# EasyEDA Pro project ProDoc_TC264主板V2.0_2025-08-21.epro, board PCB1_4
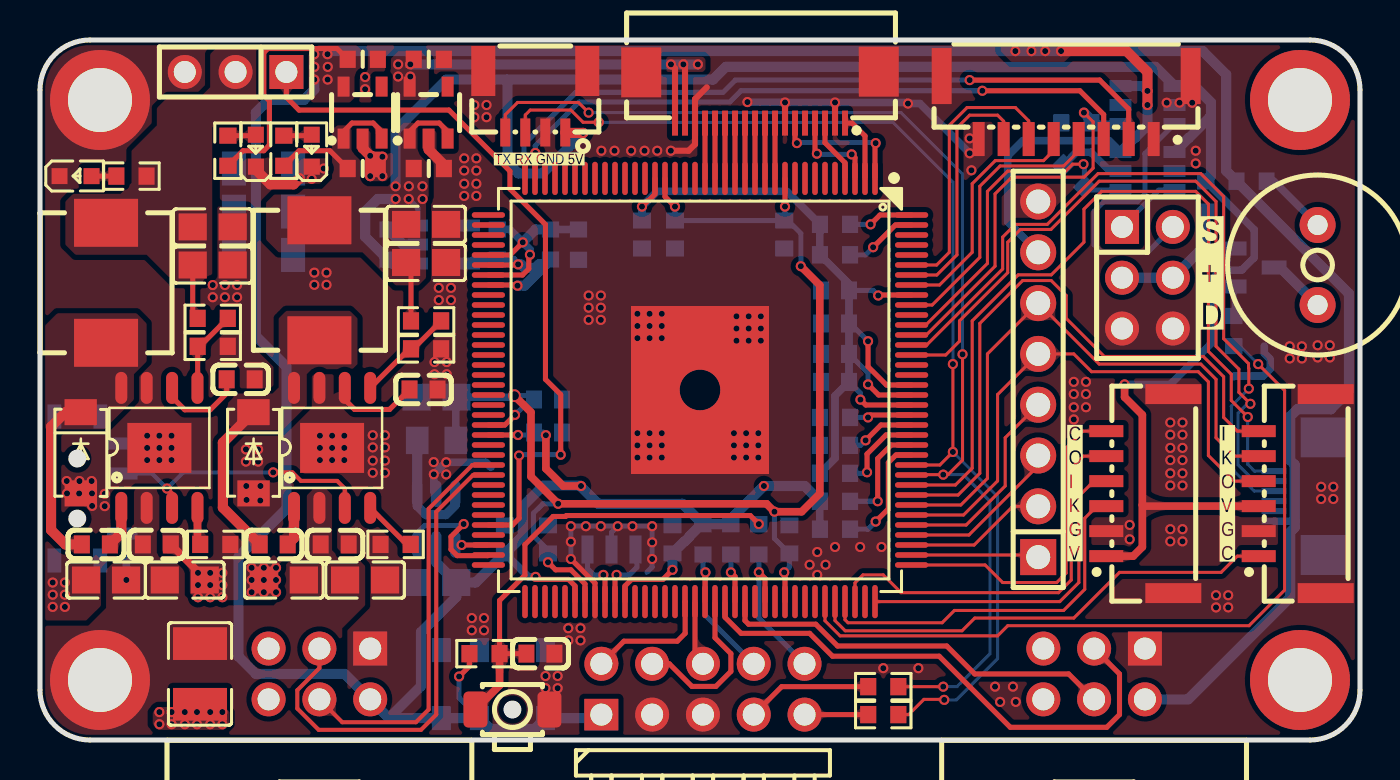
[diagram p1: board, top side]
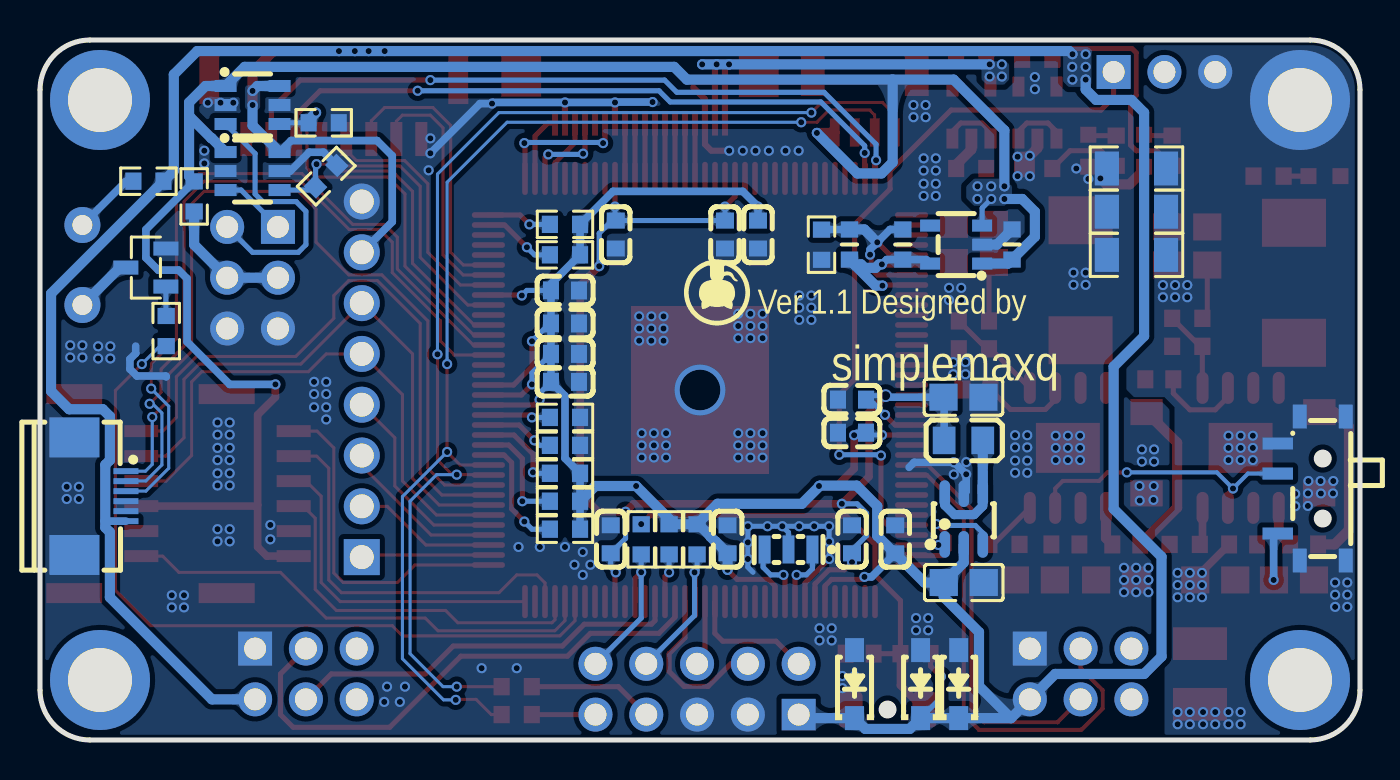
[diagram p2: board, bottom side, seen from below]

Outline 66 x 35 mm; copper layers: Top Layer, Bottom Layer. Coordinates in mm from the lower left corner of the outline.
Outline path: 0,32.5 0,2.5 arc(0.73,0.73) 2.5,0 63.5,0 arc(65.27,0.73) 66,2.5 66,32.5 arc(65.27,34.27) 63.5,35 2.5,35 arc(0.73,34.27) 0,32.5
Stack: Top Layer 0.035mm / Dielectric1 1.51mm FR4 er 4.5 / Bottom Layer 0.035mm

## Design rules (mm)
template: 自定义配置
spacing copperThickness1oz (default): track to track 0.102, other pairs 0.152 to 0.3
spacing copperThickness2oz: track to track 0.203, other pairs 0.152 to 0.3
track width copperThickness1oz (default): min 0.127, default 0.254, max 2.54
track width copperThickness2oz: min 0.203, default 0.254, max 2.54
differential pair differentialPair (default): width min 0.127, default 0.254, max 2.54; gap min 0.152, default 0.152
via viaSize (default): diameter min 0.5, default 0.61, max 10; hole min 0.3, default 0.305, max 6.3

## Placement (name value [footprint] x y rotation side)
BUZZER2  2.7kHz  [BUZ-TH_BD9.0-P4.00-D0.6-FD]  63.88 23.75 270 top
C3  100nF  [C0603]  25.02 4.32 180 top
C4  100nF  [C0603]  37.47 10.03 270 bottom
C5  100nF  [C0603]  25.4 10.03 270 bottom
C6  100nF  [C0603]  25.4 17.02 180 bottom
C7  100nF  [C0603]  31.75 25.27 90 bottom
C8  100nF  [C0603]  39.75 19.3 0 bottom
C9  100nF  [C0603]  31.62 10.03 270 bottom
C10  100nF  [C0603]  37.21 25.27 90 bottom
C11  100nF  [C0603]  39.75 20.83 0 bottom
C12  100nF  [C0603]  39.75 22.48 0 bottom
C13  100nF  [C0603]  30.1 25.27 90 bottom
C14  100nF  [C0603]  25.4 15.37 180 bottom
C15  100nF  [C0603]  23.24 10.03 270 bottom
C16  100nF  [C0603]  39.75 17.91 0 bottom
C19  22uF  [C0805]  19.81 7.87 0 bottom
C24  22uF  [C0805]  19.83 17.14 0 bottom
C30  100nF  [C0603_S]  16.13 28.58 180 top
C31  100nF  [C0603_S]  16.13 34.04 180 top
C41  100nF  [C0603_S]  17.4 24.77 270 bottom
C42  100nF  [C0603_S]  25.53 24.77 270 bottom
C43  100nF  [C0603_S]  22.86 24.77 270 bottom
C74  100nF  [C0603_S]  19.43 28.58 180 top
C75  100nF  [C0603_S]  19.43 34.04 180 top
C78  100nF  [C0603]  2.79 9.78 180 top
C79  22uF  [C0805]  8.64 23.75 180 top
C80  22uF  [C0805]  8.64 25.65 180 top
C81  100nF  [C0603]  5.84 9.78 180 top
C82  22nF  [C0603]  10.03 18.03 0 top
C83  22uF  [C0805]  3.3 8 0 top
C84  22uF  [C0805]  7.24 8 180 top
C85  100nF  [C0603]  11.68 9.78 180 top
C86  22uF  [C0805]  19.3 23.88 180 top
C87  22uF  [C0805]  19.3 25.78 180 top
C88  100nF  [C0603]  14.73 9.78 180 top
C89  22nF  [C0603]  19.18 17.53 0 top
C90  22uF  [C0805]  12.19 8 0 top
C91  22uF  [C0805]  16.26 8 180 top
CN9  2.54-2*3P弯简牛  [IDC-TH_6P-P2.54-H-R2-C3-S2.54]  13.97 3.3 0 top
CN10  2.54-2*3P弯简牛  [IDC-TH_6P-P2.54-H-R2-C3-S2.54]  52.71 3.3 0 top
CN14  WAFER-SH1.0-4PWB  [CONN-SMD_4P-P1.00_WAFER-SH1.0-4PWB]  24.76 31.75 180 top
D8  MMSZ3V6CW  [SOD-123_L2.7-W1.6-LS3.7-RD-1]  20.07 2.79 90 bottom
D9  MMSZ3V6CW  [SOD-123_L2.7-W1.6-LS3.7-RD-1]  21.97 2.79 90 bottom
D10  MMSZ3V6CW  [SOD-123_L2.7-W1.6-LS3.7-RD-1]  25.27 2.79 90 bottom
D11  SS54  [SMA_L4.3-W2.6-LS5.0-FD]  2.03 14.35 90 top
D12  SS54  [SMA_L4.3-W2.6-LS5.0-FD]  10.67 14.35 90 top
FPC1  FPC-05F-18PH20  [FPC-SMD_18P-P0.50_FPC-05F-18PH20]  36 32.13 180 top
FPC3  FPC-05F-6PH20  [FPC-SMD_6P-P0.50_XUNPU_FPC-05F-6PH20]  62.99 12.19 270 bottom
H3  PZ254V-11-03P  [HDR-TH_3P-P2.54-V-M]  9.78 33.4 180 top
H14  2.54-2*5P弯针  [HDR-TH_10P-P2.54-H-M-R2-C5-S2.54-W12.9]  33.15 2.54 0 top
H15  PZ254V-12-6P  [HDR-TH_6P-P2.54-V-M-R2-C3-S2.54]  55.37 23.11 270 top
L1  4.7uH  [L0805]  19.83 14.98 0 bottom
L12  4.7uH  [IND-SMD_L7.0-W6.6]  13.97 22.99 90 top
L13  4.7uH  [IND-SMD_L7.0-W6.6]  3.3 22.86 90 top
LED14  NCD0603R1  [LED0603-RD_RED]  10.79 29.46 90 top
LED15  NCD0603R1  [LED0603-RD_RED]  13.59 29.46 90 top
LED16  NCD0603W1  [LED0603-RD]  1.78 28.19 0 top
NOREF  -  [Pad_e54]  63 32 0 top
NOREF#2  -  [Pad_e47]  3 3 0 top
NOREF#3  -  [Pad_e51]  3 32 0 top
NOREF#4  -  [Pad_e44]  63 3 0 top
P1  2.54-1*8P母环保  [HDR-TH_8P-P2.54-V-F-1]  49.91 18.03 90 top
Q1  BSL215CH6327  [TSOP-6_L3.0-W1.5-P0.95-LS2.8-BL]  19.81 11.05 180 bottom
Q9  S8050  [SOT-23-3_L2.9-W1.3-P1.90-LS2.4-BR]  60.71 23.62 180 bottom
R1  10kΩ  [R0603]  22.22 4.32 0 top
R2  680Ω  [R0603]  35.94 10.03 270 bottom
R14  4.7K  [R0603]  59.69 20.45 90 bottom
R47  4.7kΩ  [R0603]  12.19 29.46 270 top
R48  0R  [R0603]  42.16 2.67 180 top
R49  0R  [R0603]  42.16 1.27 180 top
R69  47K  [R0603]  39.75 16.13 180 bottom
R70  47K  [R0603]  39.75 14.73 180 bottom
R71  47K  [R0603]  39.75 10.54 180 bottom
R72  47K  [R0603]  39.75 11.94 180 bottom
R73  47K  [R0603]  39.75 24.26 180 bottom
R74  47K  [R0603]  39.75 25.78 180 bottom
R75  47K  [R0603]  39.75 13.33 180 bottom
R76  10K  [R0603]  34.54 10.03 90 bottom
R77  10K  [R0603]  33.15 10.03 90 bottom
R90  4.7kΩ  [R0603]  9.4 29.46 270 top
R92  10K  [R0603]  51.69 28.19 315 bottom
R93  4.7kΩ  [R0603]  4.57 28.19 180 top
R96  N/C  [R0603]  58.29 27.18 270 bottom
R97  10K  [R0603]  51.82 30.86 0 bottom
R102  4.7Ω  [R0603]  60.58 27.94 0 bottom
R103  16.9kΩ  [R0603]  8.76 9.78 180 top
R104  91kΩ  [R0603]  8.64 21.08 180 top
R105  12kΩ  [R0603]  8.64 19.69 180 top
R106  16.9kΩ  [R0603]  17.78 9.78 0 top
R107  91kΩ  [R0603]  19.3 20.95 180 top
R108  16kΩ  [R0603]  19.3 19.56 180 top
R109  0Ω  [R1206]  11.18 28.58 180 bottom
R110  0Ω  [R1206]  11.18 26.42 180 bottom
R111  0Ω  [R1206]  11.18 24.26 180 bottom
R112  0Ω  [R0603]  26.92 24.77 90 bottom
SW1  MSK12C02  [SW-TH_MSK12C02]  2.41 12.57 90 bottom
SW2  TS-1063S-B3D4  [KEY-SMD_L3.0-W2.5-LS4.0_TS-1603S]  23.62 1.52 0 top
U1  SAK-TC264DA-40F200N BC  [LQFP-144_L20.0-W20.0-P0.50-LS22.0-BL-EP-1]  33 17.5 180 top
U2  WAFER-GH1.25-6PLB  [CONN-SMD_6P-P1.25_XUNPU_WAFER-GH1.25-6PLB]  54.99 12.32 90 top
U3  XC6210B332MR  [SOT-23-5_L3.0-W1.7-P0.95-LS2.8-BR]  16.13 31.37 270 top
U4  LP5907QMFX-3.3Q1  [SOT-23-5_L3.0-W1.7-P0.95-LS2.8-BR]  20.19 24.77 180 bottom
U50  SN74LVC1T45DBVR  [SOT-23-6_L2.9-W1.6-P0.95-LS2.8-BR]  55.37 31.75 0 bottom
U51  SN74LVC1T45DBVR  [SOT-23-6_L2.9-W1.6-P0.95-LS2.8-BR]  55.37 28.45 0 bottom
U52  WAFER-GH1.25-8PWB  [CONN-SMD_8P-P1.25_XUNPU-WAFER-GH1.25-8PWB]  51.31 31.62 180 top
U54  XC6210B332MR  [SOT-23-5_L3.0-W1.7-P0.95-LS2.8-BR]  19.43 31.37 270 top
U55  LMR14030SDDAR  [SO-8_L4.9-W3.9-P1.27-LS6.0-BL-EP]  5.97 14.61 0 top
U56  LMR14030SDDAR  [SO-8_L4.9-W3.9-P1.27-LS6.0-BL-EP]  14.6 14.61 0 top
U57  WAFER-GH1.25-6PLB  [CONN-SMD_6P-P1.25_XUNPU_WAFER-GH1.25-6PLB]  62.61 12.32 90 top
U58  100uF  [C1210]  8 3.3 90 top
X3  8MHz  [OSC-SMD_3P-L3.2-W1.3-P1.20-L]  28.57 9.53 0 bottom

## Footprints (pads in the part's own frame, mm; a bottom-side part is the same pattern mirrored in y, then rotated)
BUZ-TH_BD9.0-P4.00-D0.6-FD
  round 1.8 hole 1: 1(-2,0) 2(2,0)
C0603
  rect 0.8x0.9 smd: 1(-0.7,0) 2(0.7,0)
C0603_S
  rect 0.806x0.864 smd: 1(-0.762,0) 2(0.745,0)
C0805
  rect 1.41x1.35 smd: 1(-1,0) 2(1,0)
C1210
  rect 1.635x2.7 smd: 1(-1.518,0) 2(1.518,0)
CONN-SMD_4P-P1.00_WAFER-SH1.0-4PWB
  rect 0.5x1.4 smd: 1(-1.5,1.373) 2(-0.5,1.373) 3(0.5,1.373) 4(1.5,1.373)
  rect 1.2x2.5 smd: 5(-2.6,-1.7) 6(2.6,-1.7)
CONN-SMD_6P-P1.25_XUNPU_WAFER-GH1.25-6PLB
  rect 0.6x1.7 smd: 1(-3.125,1.675) 2(-1.875,1.675) 3(-0.625,1.675) 4(0.625,1.675) 5(1.875,1.675) 6(3.125,1.675)
  rect 1x2.8 smd: 7(4.975,-1.675) 8(-4.975,-1.675)
CONN-SMD_8P-P1.25_XUNPU-WAFER-GH1.25-8PWB
  rect 0.6x1.7 smd: 1(-4.375,1.575) 2(-3.126,1.575) 3(-1.875,1.575) 4(-0.625,1.575) 5(0.625,1.575) 6(1.875,1.575) 7(3.125,1.575) 8(4.375,1.575)
  rect 1x2.8 smd: 10(6.225,-1.575) 11(-6.225,-1.575)
FPC-SMD_6P-P0.50_XUNPU_FPC-05F-6PH20
  rect 0.3x1.25 smd: 1(-1.25,1.288) 2(-0.75,1.288) 3(-0.25,1.288) 4(0.25,1.288) 5(0.75,1.288) 6(1.25,1.288)
  rect 2x2.5 smd: 7(2.94,-1.288) 8(-2.94,-1.288)
FPC-SMD_18P-P0.50_FPC-05F-18PH20
  rect 0.3x1.25 smd: 1(-4.25,1.288) 2(-3.75,1.288) 3(-3.25,1.288) 4(-2.75,1.288) 5(-2.25,1.288) 6(-1.75,1.288) 7(-1.25,1.288) 8(-0.75,1.288) 9(-0.25,1.288) 10(0.25,1.288) 11(0.75,1.288) 12(1.25,1.288) 13(1.75,1.288) 14(2.25,1.288) 15(2.75,1.288) 16(3.25,1.288) 17(3.75,1.288) 18(4.25,1.288)
  rect 2x2.5 smd: 19(-5.94,-1.288) 20(5.94,-1.252)
HDR-TH_3P-P2.54-V-M
  rect 1.7x1.7 hole 1.1: 1(-2.54,0)
  round 1.7 hole 1.1: 2(0,0) 3(2.54,0)
HDR-TH_6P-P2.54-V-M-R2-C3-S2.54
  rect 1.7x1.7 hole 1.1: 1(-2.54,-1.27)
  round 1.7 hole 1.1: 2(-2.54,1.27) 3(0,-1.27) 4(0,1.27) 5(2.54,-1.27) 6(2.54,1.27)
HDR-TH_8P-P2.54-V-F-1
  rect 1.8x1.8 hole 1.2: 1(-8.89,0)
  round 1.8 hole 1.2: 2(-6.35,0) 3(-3.81,0) 4(-1.27,0) 5(1.27,0) 6(3.81,0) 7(6.35,0) 8(8.89,0)
HDR-TH_10P-P2.54-H-M-R2-C5-S2.54-W12.9
  rect 1.7x1.575 hole 1.1: 1(-5.08,-1.27)
  round 1.7 hole 1.1: 2(-5.08,1.27) 3(-2.54,-1.27) 4(-2.54,1.27) 5(0,-1.27) 6(0,1.27) 7(2.54,-1.27) 8(2.54,1.27) 9(5.08,-1.27) 10(5.08,1.27)
IDC-TH_6P-P2.54-H-R2-C3-S2.54
  rect 1.7x1.7 hole 1.1: 1(2.54,1.27)
  round 1.7 hole 1.1: 2(2.54,-1.27) 3(0,1.27) 4(0,-1.27) 5(-2.54,1.27) 6(-2.54,-1.27)
IND-SMD_L7.0-W6.6
  rect 2.4x3.2 smd: 1(-3,0) 2(3,0)
KEY-SMD_L3.0-W2.5-LS4.0_TS-1603S
  rrect 1.2x1.8 smd: 1(-1.85,0) 2(1.85,0)
L0805
  rect 1.133x1.377 smd: 1(-0.966,0) 2(0.966,0)
LED0603-RD
  rect 0.8x0.8 smd: 1(-0.799,0) 2(0.799,0)
LED0603-RD_RED
  rect 0.8x0.8 smd: 1(-0.799,-0.004) 2(0.799,0.004)
LQFP-144_L20.0-W20.0-P0.50-LS22.0-BL-EP-1
  oval 0.28x1.66 smd: 1(-8.75,-10.58) 2(-8.25,-10.58) 3(-7.75,-10.58) 4(-7.25,-10.58) 5(-6.75,-10.58) 6(-6.25,-10.58) 7(-5.75,-10.58) 8(-5.25,-10.58) 9(-4.75,-10.58) 10(-4.25,-10.58) 11(-3.75,-10.58) 12(-3.25,-10.58) 13(-2.75,-10.58) 14(-2.25,-10.58) 15(-1.75,-10.58) 16(-1.25,-10.58) 17(-0.75,-10.58) 18(-0.25,-10.58) 19(0.25,-10.58) 20(0.75,-10.58) 21(1.25,-10.58) 22(1.75,-10.58) 23(2.25,-10.58) 24(2.75,-10.58) 25(3.25,-10.58) 26(3.75,-10.58) 27(4.25,-10.58) 28(4.75,-10.58) 29(5.25,-10.58) 30(5.75,-10.58) 31(6.25,-10.58) 32(6.75,-10.58) 33(7.25,-10.58) 34(7.75,-10.58) 35(8.25,-10.58) 36(8.75,-10.58) 73(8.75,10.58) 74(8.25,10.58) 75(7.75,10.58) 76(7.25,10.58) 77(6.75,10.58) 78(6.25,10.58) 79(5.75,10.58) 80(5.25,10.58) 81(4.75,10.58) 82(4.25,10.58) 83(3.75,10.58) 84(3.25,10.58) 85(2.75,10.58) 86(2.25,10.58) 87(1.75,10.58) 88(1.25,10.58) 89(0.75,10.58) 90(0.25,10.58) 91(-0.25,10.58) 92(-0.75,10.58) 93(-1.25,10.58) 94(-1.75,10.58) 95(-2.25,10.58) 96(-2.75,10.58) 97(-3.25,10.58) 98(-3.75,10.58) 99(-4.25,10.58) 100(-4.75,10.58) 101(-5.25,10.58) 102(-5.75,10.58) 103(-6.25,10.58) 104(-6.75,10.58) 105(-7.25,10.58) 106(-7.75,10.58) 107(-8.25,10.58) 108(-8.75,10.58)
  oval 1.66x0.28 smd: 37(10.58,-8.75) 38(10.58,-8.25) 39(10.58,-7.75) 40(10.58,-7.25) 41(10.58,-6.75) 42(10.58,-6.25) 43(10.58,-5.75) 44(10.58,-5.25) 45(10.58,-4.75) 46(10.58,-4.25) 47(10.58,-3.75) 48(10.58,-3.25) 49(10.58,-2.75) 50(10.58,-2.25) 51(10.58,-1.75) 52(10.58,-1.25) 53(10.58,-0.75) 54(10.58,-0.25) 55(10.58,0.25) 56(10.58,0.75) 57(10.58,1.25) 58(10.58,1.75) 59(10.58,2.25) 60(10.58,2.75) 61(10.58,3.25) 62(10.58,3.75) 63(10.58,4.25) 64(10.58,4.75) 65(10.58,5.25) 66(10.58,5.75) 67(10.58,6.25) 68(10.58,6.75) 69(10.58,7.25) 70(10.58,7.75) 71(10.58,8.25) 72(10.58,8.75) 109(-10.58,8.75) 110(-10.58,8.25) 111(-10.58,7.75) 112(-10.58,7.25) 113(-10.58,6.75) 114(-10.58,6.25) 115(-10.58,5.75) 116(-10.58,5.25) 117(-10.58,4.75) 118(-10.58,4.25) 119(-10.58,3.75) 120(-10.58,3.25) 121(-10.58,2.75) 122(-10.58,2.25) 123(-10.58,1.75) 124(-10.58,1.25) 125(-10.58,0.75) 126(-10.58,0.25) 127(-10.58,-0.25) 128(-10.58,-0.75) 129(-10.58,-1.25) 130(-10.58,-1.75) 131(-10.58,-2.25) 132(-10.58,-2.75) 133(-10.58,-3.25) 134(-10.58,-3.75) 135(-10.58,-4.25) 136(-10.58,-4.75) 137(-10.58,-5.25) 138(-10.58,-5.75) 139(-10.58,-6.25) 140(-10.58,-6.75) 141(-10.58,-7.25) 142(-10.58,-7.75) 143(-10.58,-8.25) 144(-10.58,-8.75)
  rect 6.9x8.4 smd: 145(0,0)
OSC-SMD_3P-L3.2-W1.3-P1.20-L
  rect 0.6x1.4 smd: 1(-1.199,0) 2(0,0) 3(1.199,0)
Pad_e44
  round 5 hole 3.2: 1(0,0)
Pad_e47
  round 5 hole 3.2: 1(0,0)
Pad_e51
  round 5 hole 3.2: 1(0,0)
Pad_e54
  round 5 hole 3.2: 1(0,0)
R0603
  rect 0.806x0.864 smd: 1(-0.753,0) 2(0.753,0)
R1206
  rect 1.208x1.701 smd: 1(-1.479,0) 2(1.479,0)
SMA_L4.3-W2.6-LS5.0-FD
  rect 1.3x1.62 smd: 1(-2.021,-0.009) 2(2.041,-0.002)
SO-8_L4.9-W3.9-P1.27-LS6.0-BL-EP
  oval 0.6x1.6 smd: 1(-1.905,-3) 2(-0.635,-3) 3(0.635,-3) 4(1.905,-3) 5(1.905,3) 6(0.635,3) 7(-0.635,3) 8(-1.905,3)
  rect 3.2x2.5 smd: 9(0,0)
SOD-123_L2.7-W1.6-LS3.7-RD-1
  rect 1.2x0.95 smd: 1(-1.7,0) 2(1.7,0)
SOT-23-3_L2.9-W1.3-P1.90-LS2.4-BR
  rect 1.25x0.7 smd: 1(1,-0.95) 2(1,0.95) 3(-1,0)
SOT-23-5_L3.0-W1.7-P0.95-LS2.8-BR
  rect 1x0.6 smd: 1(1.3,-0.95) 2(1.3,0) 3(1.3,0.95) 4(-1.3,0.95) 5(-1.3,-0.95)
SOT-23-6_L2.9-W1.6-P0.95-LS2.8-BR
  rect 1.1x0.6 smd: 1(1.35,-0.95) 2(1.35,0) 3(1.35,0.95) 4(-1.35,0.95) 5(-1.35,0) 6(-1.35,-0.95)
SW-TH_MSK12C02
  rect 0.6x1.524 smd: 1(-2.25,1.7) 2(0.75,1.7) 3(2.25,1.7)
  rect 1.2x0.7 smd: 4(-3.6,-1.7) 4(-3.6,0.6) 4(3.6,-1.7) 4(3.6,0.6)
TSOP-6_L3.0-W1.5-P0.95-LS2.8-BL
  oval 0.532x1.336 smd: 1(-0.95,-1.268) 2(0,-1.268) 3(0.95,-1.268) 4(0.95,1.268) 5(0,1.268) 6(-0.95,1.268)

## Nets
As in the schematic, except:
12V: C81.2 C83.2 C84.2 C88.2 C90.2 C91.2 NOREF#2.1 SW1.1 U55.2 U56.2 U58.2
PGND: C79.1 C80.1 C81.1 C82.2 C83.1 C84.1 D11.1 H3.3 LED16.1 NOREF#3.1 R103.1 R105.1 R109.2 R110.2 R111.2 SW1.3 SW1.4 U55.7 U55.9 U58.1

Pads without a net: CN9 5 6; CN10 5 6; FPC1 5; NOREF 1; NOREF#4 1; U1 5 6 7 8 9 21 26 27 28 29 30 31 32 33 34 45 46 47 48 49 50 51 52 54 55 56 57 60 61 65 67 72 73 74 75 88 96 98 101 107 134; U3 4; U4 4; U54 4

## Via types
v1: diameter 0.508, hole 0.305, Top Layer to Bottom Layer, 351 vias
v2: diameter 2.54, hole 2.032, Top Layer to Bottom Layer, 1 via
v3: diameter 0.635, hole 0.457, Top Layer to Bottom Layer, 1 via

## Routing (per net, layer and track width the routed paths; a pad name or vN(x,y) marks a point on that pad's centre or on a via; arc(x,y) is an arc through that point)
1V3: length 65.6
  Top Layer w0.254: U1.99 37.25,8.34 v1(37.21,8.38) ; U1.10 v1(37.25,26.67) ; v1(31.75,26.67) 31.25,27.17 U1.22 ; U1.79 27.25,7.8 26.54,8.51 25.78,8.51 v1(25.4,8.89) ; U1.58 23.24,15.75 v1(23.75,16.26)
  Top Layer w0.381: v1(38.04,23.69) 38.99,22.74 38.99,12.32 38.08,11.41 v1(36.72,11.41) 36.33,11.81 v1(25.91,11.81) 24.55,13.17 24.55,16.39 v3(23.72,17.22)
  Bottom Layer w0.254: v1(31.75,26.67) C7.2 C10.2 ; v1(36.72,11.41) 36.72,10.08 C4.2 37.47,8.64 v1(37.21,8.38) ; v1(23.75,16.26) 24.51,17.02 C6.2 24.5,17.22 v3(23.72,17.22) ; v1(25.91,11.81) 25.15,11.81 24.67,11.34 24.67,10.22 25.4,9.49 C5.2 v1(25.4,8.89) ; C10.2 37.25,26.01 v1(37.25,26.67) ; C10.2 37.4,25.97 38.04,25.33 v1(38.04,23.69)
  Bottom Layer w0.381: 20.79,14.98 20.79,17.11 C24.2 23.64,17.14 v3(23.72,17.22)
3V3: length 274.7
  Top Layer w0.254: U1.23 30.75,27.3 30.42,26.97 30.4,26.97 v1(30.1,26.67) ; R90.2 10.15,29.46 11.19,29.46 11.47,29.75 11.47,31.96 11.19,32.24 11.19,34.37 11.4,34.57 14.85,34.57 C31.2 ; v1(20.96,3.17) 21.47,3.69 R1.1 ; U1.83 29.25,7.7 29.58,8.03 31.14,8.03 v1(31.62,8.51) ; U1.126 41.93,17.25 v1(41.4,17.78) ; U1.125 41.29,16.75 v1(41.02,17.02) ; U1.127 42.32,17.75 41.4,18.67 v1(41.4,19.94) ; U1.136 41.94,22.25 v1(41.91,22.22) ; v1(24.78,8.16) 24.91,8.03 26.42,8.03 26.75,7.7 U1.78 ; v1(23.9,15.25) U1.59
  Top Layer w0.381: v1(27.05,12.7) 26.16,12.7 25.29,13.57 v1(25.29,15.24)
  Top Layer w0.508: v1(55.37,31.75) v1(55.37,32.45) 55.37,33.4 54.33,34.45 v1(51.05,34.45)
  Bottom Layer w0.254: 24.69,15.38 24.56,15.25 v1(23.9,15.25) ; v1(41.4,19.94) 40.51,20.83 C11.2 ; C16.2 41.02,17.34 v1(41.02,17.02) ; v1(20.96,3.17) 20.96,2.11 D9.1 ; v1(41.4,17.78) 41.4,18.35 C8.2 ; C12.2 41.66,22.48 v1(41.91,22.22)
  Bottom Layer w0.305: C14.2 25.17,15.37 v1(25.29,15.24)
  Bottom Layer w0.381: v1(24.78,8.16) 24.42,8.16 C15.2 ; 62.74,10.96 62.72,10.94 FPC3.6 ; R71.2 R72.2 R75.2 39.75,14.09 39.75,17.21 C16.2 C8.2 C11.2 C12.2 40.45,22.8 R73.2 R74.2 37.35,27.43 30.86,27.43 v1(30.1,26.67) C13.2 ; U51.6 53.45,29.97 49.15,29.97 48.39,29.21 48.39,25.91 P1.7
  Bottom Layer w0.508: v1(14.38,34.29) 14.53,34.45 v1(48.77,34.45) v1(49.57,34.45) v1(50.26,34.45) v1(51.05,34.45) 58.14,34.45 59.31,33.27 59.31,28.46 R102.1 65.45,22.32 65.45,17.44 64.54,16.54 62.86,16.54 62.51,16.18 62.51,13.99 62.74,13.76 62.74,10.62 62.51,10.39 62.51,7.13 57.4,2.03 CN10.2 ; U51.6 54.72,30.09 54.74,30.09 55.37,30.73 v1(55.37,31.75) ; 17.45,1.09 19.05,2.7 19.05,5.39 20.81,7.16 C19.2 ; 17.45,1.09 CN9.2 15.24,3.3 10.79,3.3 9.92,4.17 9.92,9.16 12.32,11.56 12.32,18.67 10.79,20.19 10.79,31.37 11.43,32 13.2,32 13.72,32.52 v1(13.72,33.02) ; 17.45,1.09 D8.1 D9.1 22.51,0.55 24.73,0.55 D10.1 27.89,1.09 28.07,1.27 ; U50.6 55.13,32.7 v1(55.37,32.45) ; R77.2 32.12,11.81 27.91,11.81 27,12.72 25.17,12.72 24.14,11.69 24.14,10.21 23.26,9.33 C15.2 21.78,7.87 C19.2 ; R77.2 33.08,10.79 32.48,10.19 32.48,10.17 32.24,9.93 32.22,9.93 C9.2 v1(31.62,8.51) ; R77.2 R76.2 34.54,11.05 v1(36.19,12.7) 38.24,12.7 R72.2 ; C19.2 19.81,8.87 Q1.2
  vias: v1(13.72,34.29) v1(13.72,33.66) v1(14.39,33.66) v1(14.38,33.02)
3V3_CSI: length 20.4
  Top Layer w0.305: v1(31.55,33.78) 31.75,33.58 FPC1.18 ; v1(32.17,33.78) 32.25,33.7 FPC1.17
  Bottom Layer w0.508: v1(18.52,33.78) v1(31.55,33.78) v1(32.17,33.78) v1(32.89,33.78)
  vias: v1(17.91,33.78) v1(17.91,33.17) v1(18.52,33.17)
5V: length 114.8
  Top Layer w0.254: U54.3 20.38,30.43 19.96,30.85 18.9,30.85 18.48,30.43 18.48,30.07 ; C86.2 18.55,23.63 R107.2 ; R47.2 12.2,28.71 12.95,29.46 14.5,29.46 C30.2 ; 17.08,30.07 17.08,30.43 16.66,30.85 15.6,30.85 15.18,30.43 U3.1
  Top Layer w0.381: v1(54.23,17.78) 54.23,17.14 55.12,16.26 55.12,11.75 ; 55.12,11.75 55.18,11.69 U57.3 ; 55.12,11.75 55.12,9.65 54.66,9.19 U2.1
  Top Layer w0.508: CN14.1 26.29,30.35 v1(27.16,30.35)
  Bottom Layer w0.254: U4.3 18.89,26.59 v1(18.44,27.05)
  Bottom Layer w0.381: v1(54.23,17.78) 56.51,17.78 58.65,19.91 58.65,23.07 59.07,23.5 60.09,23.5 60.71,24.11 60.71,25.52 R96.1
  Bottom Layer w0.508: v1(27.16,30.35) 25.13,28.33 23.92,28.33 23.37,28.88 23.37,33.02 ; 58.51,31.17 58.55,31.2 58.55,31.88 57.72,32.7 U50.1 55.77,33.66 34.29,33.66 33.66,33.02 23.37,33.02 ; 58.51,31.17 58.55,31.17 58.55,28.19 R96.1 ; 58.51,31.17 57.44,30.09 57.42,30.09 U51.1 ; U4.1 17.6,23.82 C41.2 16.26,25.16 16.26,26.42 16.89,27.05 v1(17.78,27.05) ; v1(17.78,27.69) 17.78,30.48 20.32,33.02 23.37,33.02
  vias: v1(18.44,27.69) v1(19.12,27.69) v1(19.13,27.05)
7.4V: length 2.8
  Top Layer w0.254: R104.2 7.64,21.33 C79.2
12V: length 2.4
  Bottom Layer w0.381: SW1.1 4.32,10.12 v1(4.32,8)
AGND: length 10.2
  Top Layer w0.254: U1.43 24.13,23.25 24.44,23.56 24.44,24.21 v1(24.5,24.27) ; v1(24.14,24.88) 23.5,24.25 U1.41
  Bottom Layer w0.381: v1(24.5,24.27) 24.5,24.52 v1(24.14,24.88) 23.49,25.53 C43.1 ; R112.2 26.92,25.53 C42.1
  Bottom Layer w0.508: C42.1 24.78,25.53 v1(24.14,24.88)
AVCC: length 9.3
  Top Layer w0.254: v1(23.91,23.78) 23.87,23.75 U1.42 ; U1.44 23.84,22.75 v1(23.88,22.72)
  Bottom Layer w0.381: v1(23.91,23.78) 23.67,24.02 C43.2 21.69,24.02 21.49,23.82
  Bottom Layer w0.508: 25.29,23.78 24.95,23.78 24.77,23.61 24.22,23.61 24.05,23.78 v1(23.91,23.78) ; 25.29,23.78 24.22,22.72 v1(23.88,22.72) ; 25.29,23.78 C42.2
GND: length 50.8
  Top Layer w0.254: U1.80 27.75,7.84 v1(26.54,9.05)
  Top Layer w0.305: FPC1.2 v1(39.75,31.88) ; FPC1.7 v1(37.25,31.88) ; v1(31.54,29.46) 32.43,29.46 32.75,29.78 FPC1.16 32.75,32.04 33.34,32.63
  Top Layer w0.508: v1(17.12,29.16) 16.61,29.16 16.56,29.21 v1(16.51,29.21) ; U3.2 16.13,29.59 v1(16.51,29.21) ; C74.1 20.19,28.76 19.43,29.52 U54.2 ; v1(16.51,29.21) v1(16.51,28.19) ; v1(12.98,28.08) 12.97,28.08 12.67,27.78 11.52,27.78 10.8,28.51 LED14.1
  Bottom Layer w0.254: X3.2 28.57,10.38 v1(28.88,10.69) ; 30.35,8.39 30.61,8.64 v1(30.61,9.88) v1(30.61,10.69) v1(29.62,10.69) v1(28.88,10.69) ; v1(28.88,10.69) v1(28.04,10.69) v1(27.29,10.69) v1(26.54,10.69) v1(26.54,9.91) v1(26.54,9.05)
  Bottom Layer w0.381: Q1.5 19.69,12.44 v1(19.69,13.29) 20.29,13.89 v1(20.31,13.89) 22.29,13.89 22.54,13.63 ; 59.69,18.16 59.69,18.17 59.72,18.2 61.16,18.2 61.5,18.55 61.5,19.04 61.21,19.33 61.21,19.69 ; v1(46.48,29.34) 44,31.82 v1(43.4,31.82) 43.34,31.88 v1(39.75,31.88) v1(37.25,31.88) 37.23,31.9 v1(35.37,31.9) ; R92.1 51.82,29.39 52.54,29.39 53.48,28.45 U51.5
  Bottom Layer w0.508: U4.2 18.16,24.77 C41.1
  vias: v1(10.3,14.53) v1(10.3,13.92) v1(10.31,12.7) v1(10.33,12) v1(10.58,8.61) v1(10.58,8) v1(10.58,7.39) v1(10.91,14.53) v1(10.91,13.92) v1(11.02,12.7) v1(11.01,11.97) v1(11.19,8.61) v1(11.19,8) v1(11.19,7.39) v1(11.8,8.61) v1(11.8,8) v1(11.8,7.39) v1(13.58,28.06) v1(13.72,23.37) v1(13.72,22.76) v1(14,15.21) v1(14,14.61) v1(14,14) v1(14.19,28.58) v1(14.33,23.37) v1(14.33,22.76) v1(14.6,15.21) v1(14.6,14.61) v1(14.6,14) v1(15.21,15.21) v1(15.21,14.61) v1(15.21,14) v1(16.26,33.15) v1(16.26,32.54) v1(16.64,15.24) v1(16.64,14.63) v1(16.64,13.97) v1(16.64,13.36) v1(17.12,28.19) v1(17.25,15.24) v1(17.25,14.63) v1(17.25,13.97) v1(17.25,13.36) v1(19.73,18.9) v1(19.73,18.29) v1(19.69,13.89) v1(19.94,22.61) v1(19.94,22) v1(20.34,18.9) v1(20.34,18.29) v1(20.31,13.28) v1(20.55,22.61) v1(20.55,22) v1(21.21,29.08) v1(21.21,28.47) v1(21.21,27.81) v1(21.21,27.2) v1(21.59,6.1) v1(21.59,5.49) v1(21.72,31.75) v1(21.72,31.14) v1(21.82,29.08) v1(21.82,28.47) v1(21.82,27.81) v1(21.82,27.2) v1(22.2,6.1) v1(22.2,5.49) v1(22.33,31.75) v1(22.33,31.14) v1(25.27,3.2) v1(25.27,2.59) v1(25.88,3.2) v1(25.88,2.59) v1(26.42,5.59) v1(26.42,4.98) v1(27.03,5.59) v1(27.03,4.98) v1(27.43,22.22) v1(27.43,21.62) v1(27.43,21.01) v1(28.04,22.22) v1(28.04,21.62) v1(28.04,21.01) v1(28.07,29.46) v1(28.73,29.46) v1(29.56,29.46) v1(29.87,21.31) v1(29.87,20.7) v1(29.87,20.09) v1(29.87,15.34) v1(29.87,14.73) v1(29.87,14.12) v1(30.23,29.46) v1(30.48,21.31) v1(30.48,20.7) v1(30.48,20.09) v1(30.48,15.34) v1(30.48,14.73) v1(30.48,14.12) v1(30.61,9.05) v1(30.86,29.46) v1(31.09,21.31) v1(31.09,20.7) v1(31.09,20.09) v1(31.09,15.34) v1(31.09,14.73) v1(31.09,14.12) v1(34.7,15.34) v1(34.7,14.73) v1(34.7,14.12) v1(34.82,21.18) v1(34.82,20.57) v1(34.82,19.96) v1(35.31,15.34) v1(35.31,14.73) v1(35.31,14.12) v1(35.43,21.18) v1(35.43,20.57) v1(35.43,19.96) v1(35.92,15.34) v1(35.92,14.73) v1(35.92,14.12) v1(36.04,21.18) v1(36.04,20.57) v1(36.04,19.96) v1(38.48,8.76) v1(38.86,9.4) v1(38.86,8.25) v1(39.28,8.76) v1(39.75,9.65) v1(41.01,9.65) v1(42.07,9.65) v1(42.16,3.59) v1(43.92,3.59) v1(46.48,30.08) v1(46.57,28.49) v1(47.75,2.67) v1(48.01,1.91) v1(48.65,2.67) v1(48.79,1.91) v1(51.69,17.91) v1(51.69,17.3) v1(51.69,16.64) v1(51.69,16.03) v1(52.3,17.91) v1(52.3,17.3) v1(52.3,16.64) v1(54.48,10.75) v1(54.48,10.03) v1(56.33,31.86) v1(56.51,15.88) v1(56.51,15.27) v1(56.51,14.61) v1(56.51,14) v1(56.51,13.33) v1(56.51,12.73) v1(56.51,10.54) v1(56.51,9.93) v1(56.97,31.86) v1(57.12,15.88) v1(57.12,15.27) v1(57.12,14.61) v1(57.12,14) v1(57.12,13.33) v1(57.12,12.73) v1(57.12,10.54) v1(57.12,9.93) v1(57.61,31.86) v1(57.78,29.46) v1(57.78,28.83) v1(58.8,7.24) v1(58.8,6.63) v1(59.41,7.24) v1(59.41,6.63) v1(62.48,19.69) v1(62.48,19.08) v1(63.09,19.69) v1(63.09,19.08) v1(63.88,19.74) v1(63.88,19.13) v1(64.06,12.66) v1(64.06,12.05) v1(64.49,19.74) v1(64.49,19.13) v1(64.66,12.66) v1(64.66,12.05) v2(33,17.5)
PGND: length 2
  Top Layer w0.381: v1(7.9,8.36) 7.9,8.42 C81.1
  vias: v1(0.64,7.87) v1(0.64,7.26) v1(0.64,6.66) v1(1.24,7.87) v1(1.24,7.26) v1(1.24,6.66) v1(1.34,12.95) v1(1.35,12.33) v1(1.97,12.95) v1(1.96,12.33) v1(2.58,12.95) v1(2.6,12.33) v1(2.61,11.7) v1(3.24,12.31) v1(3.24,11.69) v1(5.36,15.21) v1(5.36,14.61) v1(5.36,14) v1(5.97,15.21) v1(5.97,14.61) v1(5.97,14) v1(5.97,1.4) v1(5.97,0.79) v1(6.58,15.21) v1(6.58,14.61) v1(6.58,14) v1(6.58,1.4) v1(6.58,0.79) v1(7.24,1.4) v1(7.24,0.79) v1(7.85,1.4) v1(7.85,0.79) v1(7.9,7.75) v1(7.9,7.14) v1(8.51,8.36) v1(8.51,7.75) v1(8.51,7.14) v1(8.51,1.4) v1(8.51,0.79) v1(8.64,22.75) v1(8.64,22.14) v1(9.12,8.36) v1(9.12,7.75) v1(9.12,7.14) v1(9.12,1.4) v1(9.12,0.79) v1(9.25,22.75) v1(9.25,22.14) v1(9.85,22.75) v1(9.85,22.14)
BEEP_ATOM1_CH5_P20_9: length 38.6
  Top Layer w0.152: v1(60.91,18.8) 62.23,17.47 62.23,7.49 60.45,5.72 48.39,5.72 47.88,5.21 40,5.21 39.25,5.96 U1.103
  Bottom Layer w0.152: v1(60.91,18.8) 60.01,19.69 R14.1
CAM1: length 2.8
  Top Layer w0.254: FPC1.8 36.75,28.08
CAM2: length 2.8
  Top Layer w0.254: FPC1.9 36.25,28.08
CAM3: length 2.8
  Top Layer w0.254: FPC1.10 35.75,28.08
CAM4: length 2.8
  Top Layer w0.254: FPC1.11 35.25,28.08
CAM5: length 2.8
  Top Layer w0.254: FPC1.12 34.75,28.08
CAM6: length 2.8
  Top Layer w0.254: FPC1.13 34.25,28.08
CAM7: length 2.8
  Top Layer w0.254: FPC1.14 33.75,28.08
CAM8: length 2.8
  Top Layer w0.254: FPC1.15 33.25,28.08
CAMPCLK: length 3.4
  Top Layer w0.254: FPC1.1 40.61,30.84 41.25,30.2 U1.2
CAMRXD: length 3.2
  Top Layer w0.254: FPC1.3 39.25,29.86 40.25,28.86 U1.4
CAMTXD: length 4.6
  Top Layer w0.254: v1(40.58,29.28) 40.75,29.12 U1.3 ; FPC1.4 38.75,29.41 v1(38.84,29.32)
  Bottom Layer w0.254: v1(40.58,29.28) 38.88,29.28 v1(38.84,29.32)
CAMVSY: length 6.8
  Top Layer w0.254: U1.1 41.75,29.81 v1(41.78,29.84) ; v1(37.85,29.84) 37.75,29.94 FPC1.6
  Bottom Layer w0.254: v1(37.85,29.84) 37.88,29.88 41.75,29.88 v1(41.78,29.84)
CCW: length 41.8
  Top Layer w0.152: U1.117 45.77,12.75 46.61,13.59 46.61,20.95 48.91,23.26 50.56,23.26 52.2,24.89 52.2,26.54 53.09,27.43 57.78,27.43 58.42,26.8 58.42,19.43 59.56,18.29 59.56,16.98 v1(60.39,16.15)
  Bottom Layer w0.152: FPC3.1 60.73,13.44 60.39,13.78 v1(60.39,16.15)
CW: length 37.1
  Top Layer w0.152: v1(60.52,16.81) 59.94,17.38 59.94,18.54 58.8,19.69 58.8,26.92 57.78,27.94 52.96,27.94 50.55,25.53 49.02,25.53 48.39,24.89 48.39,23.37 45.97,20.95 45.97,19.94 45.28,19.25 U1.130
  Bottom Layer w0.152: FPC3.2 61.69,12.95 60.71,12.95 59.91,13.75 59.91,16.35 60.37,16.81 v1(60.52,16.81)
EN: length 14.1
  Top Layer w0.203: U56.3 15.24,12.57 14.86,12.95 13.05,12.95 12.62,13.38 v1(11.66,13.38) ; v1(6.35,12.57) 6.6,12.32 U55.3
  Bottom Layer w0.203: SW1.2 5.6,13.32 v1(6.35,12.57) 7.16,13.38 v1(11.66,13.38)
EN1_ATOM2_CH6_P11_11: length 12.6
  Top Layer w0.152: U1.138 44.84,23.25 45.85,24.26 45.85,30.61 46.48,31.24 47.88,31.24 48.18,30.94 U52.7
EN2_ATOM2_CH5_P11_10: length 12.5
  Top Layer w0.152: U52.5 50.68,29.47 50.18,28.97 47.77,28.97 46.61,27.81 46.61,24.38 44.97,22.75 U1.137
IMU_CS: length 17
  Top Layer w0.152: 53.37,15.44 52.15,15.44 51.31,14.61 51.31,8.35 50.84,7.87 48.13,7.87 47.26,8.75 U1.109
IMU_SDI: length 16.6
  Top Layer w0.152: U1.108 50.99,6.92 51.94,7.87 51.94,12.19 52.69,12.94 53.37,12.94
IMU_SDO: length 20.2
  Top Layer w0.152: 53.37,14.19 52.17,14.19 51.56,13.59 51.56,8 50.93,7.37 43.05,7.37 42.16,8.25 41.15,8.25 40.75,7.86 U1.106
IMU_SPC: length 18.5
  Top Layer w0.152: U2.3 52.84,11.69 52.24,11.09 52.24,7.53 51.18,6.48 45.72,6.48 45.1,5.86 40.4,5.86 40.25,6.01 U1.105
IPS_BLK: length 6.4
  Top Layer w0.152: U1.110 49.81,9.25 P1.1
IPS_CS: length 7.1
  Top Layer w0.152: P1.2 48.64,11.68 46.71,9.75 U1.111
IPS_DC: length 8.3
  Top Layer w0.152: U1.112 46.44,10.25 49.91,13.72 P1.3
IPS_MOSI: length 28
  Top Layer w0.152: U1.114 46.18,11.25 47.88,12.95 47.88,17.27 P1.5 51.69,19.3 52.58,18.42 57.91,18.42 58.42,17.91 58.42,14.22 59.7,12.94 U57.4
IPS_RST: length 10.2
  Top Layer w0.152: U1.113 46.31,10.75 48.26,12.7 48.26,15.11 P1.4
IPS_SCK: length 30.1
  Top Layer w0.152: U1.115 46.04,11.75 47.37,13.08 47.37,19.3 P1.6 52.96,18.8 58.04,18.8 58.8,18.03 58.8,15.11 59.72,14.19 U57.5
LFAN_ATOM3_CH2_P11_3: length 17.1
  Top Layer w0.152: U1.133 44.29,20.75 47.37,23.83 47.37,27.43 48.39,28.45 51.29,28.45 51.63,28.79 v1(52.17,28.79)
  Bottom Layer w0.254: U51.4 52.38,27.5 R92.2 52.22,28.74 v1(52.17,28.79)
LFAN_PWM: length 3.4
  Bottom Layer w0.254: U51.3 55.95,27.5 H15.1
M1A: length 20.1
  Top Layer w0.203: CN9.4 15.11,0.89 18.8,0.89 19.43,1.52 19.43,11.56 21.62,13.75 U1.62
M1B: length 24.7
  Top Layer w0.203: U1.63 21.65,13.25 19.81,11.41 19.81,1.27 19.05,0.51 13.93,0.51 12.87,1.58 12.87,2.49 13.97,3.59 CN9.3
M2A: length 20
  Top Layer w0.254: U1.95 35.25,5.97 35.43,5.79 38.79,5.79 39.88,4.7 45.34,4.7 46.74,3.3 51.44,3.3 CN10.4
M2B: length 26.9
  Top Layer w0.254: U1.93 34.25,6.14 35.05,5.33 38.48,5.33 39.62,4.19 44.96,4.19 48.51,0.64 53.34,0.64 53.97,1.27 53.97,3.3 CN10.3
P14.2: length 6
  Top Layer w0.254: U1.120 42.8,14.25 42.42,13.87 42.42,11.56 v1(41.78,10.92)
  Bottom Layer w0.254: v1(41.78,10.92) 41.4,10.54 R71.1
P14.3: length 5.5
  Top Layer w0.254: U1.121 42.56,14.75 41.88,14.07 v1(41.88,11.94)
  Bottom Layer w0.254: R72.1 v1(41.88,11.94)
P14.4: length 4.4
  Top Layer w0.254: v1(41.35,13.39) 41.35,14.3 42.3,15.25 U1.122
  Bottom Layer w0.254: R75.1 41.3,13.33 v1(41.35,13.39)
P14.5: length 3.5
  Top Layer w0.254: U1.123 42.05,15.75 v1(41.28,14.98)
  Bottom Layer w0.254: R70.1 41.03,14.73 v1(41.28,14.98)
P14.6: length 3.1
  Top Layer w0.254: U1.124 41.52,16.25 v1(41.4,16.13)
  Bottom Layer w0.254: R69.1 v1(41.4,16.13)
P20.2: length 2.4
  Top Layer w0.254: U1.94 34.75,8.18 v1(34.54,8.38)
  Bottom Layer w0.254: R76.1 v1(34.54,8.38)
PH1_ATOM2_CH7_P11_12: length 14
  Top Layer w0.152: U1.139 44.83,23.75 45.47,24.38 45.47,30.73 46.35,31.62 48.77,31.62 49.43,30.96 U52.6
PH2_ATOM2_CH4_P11_9: length 14.2
  Top Layer w0.152: U1.135 44.61,21.75 46.99,24.13 46.99,27.69 48.01,28.7 51.18,28.7 51.94,29.46 51.94,30.04 U52.4
PRESS: length 37.7
  Top Layer w0.152: U1.131 44.1,19.75 44.11,19.77 44.35,19.77 48.13,23.55 48.13,25.15 48.77,25.78 50.36,25.78 52.9,28.32 58.04,28.32 59.18,27.18 59.18,20.07 60.43,18.82 60.43,18.6 60.44,18.58 v1(60.44,17.57)
  Bottom Layer w0.152: v1(60.44,17.57) 59.56,16.69 59.56,13.59 60.71,12.45 61.7,12.45 FPC3.3
PUSH: length 3.7
  Top Layer w0.254: U1.143 42.77,25.75 v1(41.66,24.64)
  Bottom Layer w0.254: R73.1 41.28,24.26 v1(41.66,24.64)
RFAN_ATOM3_CH1_P11_2: length 19.8
  Top Layer w0.152: U1.132 44.31,20.25 47.75,23.69 47.75,27.31 48.59,28.14 52.21,28.14 52.66,28.59 52.66,30.91 v1(52.2,31.37)
  Bottom Layer w0.254: U50.4 53.96,30.86 R97.2
  Bottom Layer w0.508: v1(52.2,31.37) 52.57,31 R97.2
RFAN_PWM: length 13.3
  Bottom Layer w0.254: U50.3 55.25,29.32 55.25,27.3 54.86,26.92 53.19,26.92 52.71,26.43 52.71,24.77 53.09,24.38 55.37,24.38 H15.2
RST: length 8
  Top Layer w0.254: U1.97 36.25,8.08 v1(35.94,8.39)
  Bottom Layer w0.254: H14.10 35.94,6.1 v1(35.94,8.39) R2.2
RX: length 57.1
  Top Layer w0.152: v1(45.64,18.8) v1(45.64,14.4) 44.99,13.75 U1.119 ; CN14.3 24.26,31.25 24.51,31.5 26.54,31.5 27.15,30.89 v1(27.94,30.89) ; R49.1 43.43,1.27 44.2,2.03 45.19,2.03 v1(45.21,2.01)
  Bottom Layer w0.152: v1(45.64,14.4) 47.88,12.17 47.88,4.06 45.82,2.01 v1(45.21,2.01) ; v1(45.64,18.8) 45.64,27.89 42.65,30.89 v1(27.94,30.89)
SO1: length 35.4
  Top Layer w0.254: U1.36 24.25,28.93 v1(24.2,28.99) ; U52.2 54.43,31.55 52.98,33 v1(46.48,33)
  Bottom Layer w0.254: v1(46.48,33) 34.77,33 34.16,32.39 26.8,32.39 24.2,29.78 v1(24.2,28.99)
SO2: length 32.9
  Top Layer w0.254: v1(24.76,29.35) 24.76,28.09 U1.35 ; U52.3 53.18,31.27 51.99,32.46 v1(47.12,32.46)
  Bottom Layer w0.254: v1(47.12,32.46) 35.05,32.46 34.49,31.9 26.96,31.9 24.76,29.71 v1(24.76,29.35)
SPI2_MISO_P15_7: length 31.2
  Top Layer w0.152: U57.6 59.87,15.44 59.18,16.13 59.18,18.16 58.17,19.18 53.21,19.18 51.31,21.08 51.31,22.22 50.56,22.97 49.13,22.97 46.99,20.83 46.99,13.33 45.91,12.25 U1.116
STEER_PWM: length 36.1
  Top Layer w0.254: v1(26.03,14.26) 26.03,17.27 25.27,18.03 25.27,25.77 23.5,27.55 23.5,28.45 20.45,31.5 12.95,31.5 12.32,32.13 H3.1 ; v1(23.95,14.22) 23.95,11.08 23.62,10.75 U1.68
  Bottom Layer w0.254: v1(26.03,14.26) 23.99,14.26 v1(23.95,14.22)
TCK: length 8.5
  Top Layer w0.254: H14.4 31.47,3.81 32.59,2.68 33.8,2.68 34.54,3.43 34.54,4.32 33.75,5.11 U1.92
TDO: length 3.3
  Top Layer w0.254: H14.6 32.75,4.21 U1.90
TMS: length 6.4
  Top Layer w0.254: U1.89 32.26,6.91 32.26,5.33 31.86,4.94 29.2,4.94 28.07,3.81
TRST: length 8
  Top Layer w0.254: v1(33.27,8.38) 33.25,8.36 U1.91
  Bottom Layer w0.254: R77.1 33.15,8.51 v1(33.27,8.38) 33.27,6.22 35.69,3.81
TX: length 58.4
  Top Layer w0.152: R48.1 v1(45.16,2.67) ; v1(46.13,19.28) 46.13,14 45.4,13.27 v1(45.16,13.27) 43.6,13.27 U1.118 ; CN14.4 23.26,31.27 23.88,31.88 26.92,31.88 v1(27.43,31.37)
  Bottom Layer w0.152: v1(45.16,2.67) 45.85,2.67 47.5,4.32 47.5,11.94 46.17,13.27 v1(45.16,13.27) ; v1(27.43,31.37) 43.05,31.37 46.13,28.3 v1(46.13,19.28)
UP: length 3.3
  Top Layer w0.254: U1.144 42,26.25 v1(41.53,25.78)
  Bottom Layer w0.254: v1(41.53,25.78) R74.1
VFB: length 4.2
  Top Layer w0.254: U55.5 7.88,17.61 R105.2 7.99,19.69 R104.1
VFB2: length 4.9
  Top Layer w0.254: R107.1 18.66,19.56 R108.2 18.46,19.56 U56.5
VGATE1N: length 1.7
  Top Layer w0.254: U1.70 v1(21.08,9.75)
  Bottom Layer w0.254: Q1.1 21.05,9.78 v1(21.08,9.75)
WIFI_CS: length 23.9
  Top Layer w0.152: U57.1 59.87,9.19 59.06,8.38 53.97,8.38 51.69,6.1 46.74,6.1 46.1,5.46 40.26,5.46 39.75,5.97 U1.104
$1N6405: length 3.5
  Top Layer w0.254: v1(28.83,8.25) 28.75,8.18 U1.82
  Bottom Layer w0.254: X3.3 29.84,9.45 29.84,8.64 29.46,8.25 v1(28.83,8.25)
$1N6406: length 3.2
  Top Layer w0.254: U1.81 28.25,8.17 v1(28.17,8.25)
  Bottom Layer w0.254: X3.1 27.38,8.56 27.69,8.25 v1(28.17,8.25)
$1N6408: length 23.1
  Top Layer w0.254: v1(35.94,10.8) 35.51,11.22 26.32,11.22 26.28,11.18 25.65,11.18 24.25,9.77 24.25,8.24 22.98,6.98 R1.2 C3.2
  Top Layer w0.381: SW2.1 22.98,2.73 R1.2
$1N6427: length 6.6
  Top Layer w0.254: v1(21.18,10.8) 20.55,10.16 20.55,9.53 20.86,9.22 22.39,9.22 U1.71
  Bottom Layer w0.254: v1(21.18,10.8) 21.11,10.73 19.24,10.73 18.86,10.35 Q1.3
$1N6436: length 6.1
  Bottom Layer w0.457: Q1.4 18.86,11.7 19.29,11.27 20.29,11.27 20.76,11.75 Q1.6
  Bottom Layer w0.508: Q1.4 18.86,14.98
$1N16587: length 3
  Bottom Layer w0.508: Q9.3 62.01,23.62 BUZZER2.2
$1N16655: length 1.5
  Bottom Layer w0.254: R14.2 59.71,21.22 Q9.1
$1N25910: length 1.4
  Top Layer w0.254: LED14.2 10.75,30.22 R90.1
$1N25915: length 1.4
  Top Layer w0.254: LED15.2 13.54,30.22 R47.1
$1N29216: length 6.3
  Top Layer w0.254: 35.69,1.27 37.08,2.67 R48.2
$1N29218: length 3.2
  Top Layer w0.254: H14.9 R49.2
$1N41074: length 1.2
  Top Layer w0.254: LED16.2 R93.2
$1N52937: length 6.5
  Bottom Layer w0.508: R96.2 58.29,24.77 H15.4 H15.3
$1N74099: length 3.5
  Bottom Layer w0.381: R102.2 61.69,27.94 BUZZER2.1
$1N77605: length 8.8
  Top Layer w0.508: C78.2 1.27,9.78 0.55,10.5 0.55,15.67 1.28,16.39 D11.2
$1N77829: length 4.5
  Top Layer w0.254: U55.6 6.6,17.14 7.24,16.51 8.51,16.51 9.33,17.33 C82.1
$1N78061: length 1.9
  Top Layer w0.381: U55.4 7.87,9.91 R103.2
$1N78386: length 2.1
  Top Layer w0.508: U55.1 4.06,10.35 C78.1
$1N78931: length 8
  Top Layer w0.508: C85.2 9.14,11.62 9.14,14.87 D12.2
$1N78939: length 2
  Top Layer w0.508: U56.1 12.7,10.09 C85.1
$1N78949: length 2.8
  Top Layer w0.254: R106.2 18.34,9.78 U56.4
$1N78966: length 4.4
  Top Layer w0.254: U56.6 15.24,17.02 15.73,16.53 17.48,16.53 C89.1

## Copper pours and planes (outline as drawn; the poured copper is in the pictures)
3V3 on Top Layer: 13.34,34.16 13.97,34.8 15.76,34.8 16.14,34.42 16.14,33.59 15.73,33.18 15.73,32.11 15.49,31.88 13.62,31.88 13.34,32.17
3V3 on Top Layer: 48.39,35.31 48.02,34.94 48.02,34.45 48.56,33.91 51.23,33.91 51.76,34.45 51.76,34.85 51.3,35.31
3V3 on Bottom Layer: 13.34,34.4 13.59,34.65 14.56,34.65 14.85,34.36 14.85,32.92 14.58,32.65 13.57,32.65 13.34,32.89
3V3_CSI on Top Layer: 17.52,34.04 17.93,34.45 19.03,34.45 19.44,34.04 19.44,32.14 19.3,32 17.66,32 17.52,32.14
3V3_CSI on Top Layer: 31.12,34.04 31.24,34.16 33.15,34.16 33.27,34.04 33.27,33.53 33.15,33.4 31.24,33.4 31.12,33.53
3V3_CSI on Bottom Layer: 17.54,33.78 17.8,34.04 18.67,34.04 18.92,33.78 18.92,33.02 18.67,32.77 17.79,32.77 17.54,33.02
5V on Top Layer: 12,27.56 14.1,27.56 14.6,28.07 14.6,30.48 14.86,30.73 15.36,30.73 15.6,30.49 15.6,29.61 16.14,29.07 16.14,27.93 16.38,27.69 17.4,27.69 17.91,28.19 17.91,30.61 18.16,30.86 18.67,30.86 18.92,30.61 18.92,29.59 19.43,29.09 19.43,27.18 19.3,27.05 19.3,23.11 18.93,22.73 17.78,22.73 16.13,24.38 11.94,24.38 11.3,25.02 11.3,26.87
5V on Bottom Layer: 17.4,27.69 17.78,28.07 19.3,28.07 19.69,27.69 19.69,27.09 19.3,26.71 17.77,26.71 17.38,27.09 17.4,27.11
7.4V on Top Layer: 1.27,26.92 1.65,27.31 4.02,27.31 4.57,27.85 4.57,29.46 5.84,30.73 5.84,31.6 6.39,32.15 8.02,32.15 8.51,32.64 8.51,34.3 8.86,34.65 10.73,34.65 11.05,34.33 11.05,31.25 10.65,30.85 8.83,30.85 8.61,30.63 8.61,23.22 8.24,22.85 6.75,22.85 5.33,24.26 1.78,24.26 1.27,24.77
12V on Top Layer: -1.91,3.68 0.13,5.72 2.41,5.72 3.3,6.6 3.3,8.5 3.7,8.9 4.16,8.9 4.41,9.15 4.41,10.5 4.7,10.8 4.7,12.45 4.83,12.57 5.84,12.57 5.97,12.45 5.97,10.54 5.84,10.41 5.84,9.36 6.14,9.06 6.94,9.06 7.24,8.76 7.24,7.24 7.75,6.73 11.68,6.73 12.19,7.24 12.19,8.66 12.59,9.06 13.03,9.06 13.34,9.38 13.34,12.23 13.71,12.61 14.26,12.61 14.6,12.27 14.6,9.49 15.03,9.06 15.89,9.06 16.26,8.7 16.26,6.73 15.11,5.59 15.11,-0.14 13.49,-1.77 -0.14,-1.77 -1.91,0
GND on Top Layer: -3.68,32.51 0.89,37.08 63.12,37.08 67.56,32.64 67.56,-4.7 63.12,-9.14 0.89,-9.14 -3.68,-4.57
GND on Bottom Layer: -3.3,39.12 70.23,39.12 78.23,31.11 78.23,0.13 70.23,-7.87 -3.94,-7.87 -11.81,0 -11.81,30.61
PGND on Top Layer: -3.17,33.02 -0.64,35.56 9.84,35.56 11.05,34.35 11.05,31.12 10.78,30.85 8.93,30.85 8.74,30.66 8.74,26.95 9.02,26.67 10.36,26.67 10.61,26.42 10.61,19.72 11.67,18.65 11.67,17.64 11.3,17.27 9.78,17.27 8.89,16.38 8.89,11.58 10.29,10.18 10.29,9.2 9.92,8.83 9.92,-3.03 7.75,-5.21 -0.51,-5.21 -3.17,-2.54
PGND on Top Layer: 5.89,1.65 9.22,1.65 9.48,1.4 9.48,0.79 9.19,0.5 5.92,0.5 5.64,0.79 5.64,1.39
PGND on Bottom Layer: -0.89,35.94 9.54,35.94 10.83,34.65 10.83,31.28 10.54,30.99 10.54,20.07 11.68,18.92 11.68,17.53 11.3,17.14 9.78,17.14 9.27,16.64 9.27,11.49 10.26,10.51 10.26,9.37 9.78,8.89 9.78,-1.02 6.86,-3.94 -1.14,-3.94 -4.19,-0.89 -4.19,32.64
$1N77605 on Top Layer: 0,20.47 0.86,21.34 4.83,21.34 5.33,20.83 5.33,18.92 4.7,18.29 4.7,17.02 3.21,15.53 0,15.53
$1N78931 on Top Layer: 9.4,16.76 9.4,16.97 9.75,17.32 11.63,17.32 11.94,17.63 11.94,21.08 12.32,21.46 15.49,21.46 15.88,21.08 15.88,18.8 15.62,18.54 13.59,18.54 13.34,18.29 13.34,16.7 12.1,15.47 9.73,15.47 9.38,15.82 9.38,16.75

Small or netless copper shapes (teardrops, artwork), in the pictures only: 162 on Top Layer, 215 on Bottom Layer

## Text on the board
Bottom Silkscreen Layer: Ver 1.1 Designed by | simplemaxq
Top Silkscreen Layer: TX RX GND 5V | C / O / I / K / G / V | I / K / O / V / G / C | S / + / D
